# EAGLE design Design2d_fertig (EAGLE 7.2.0)
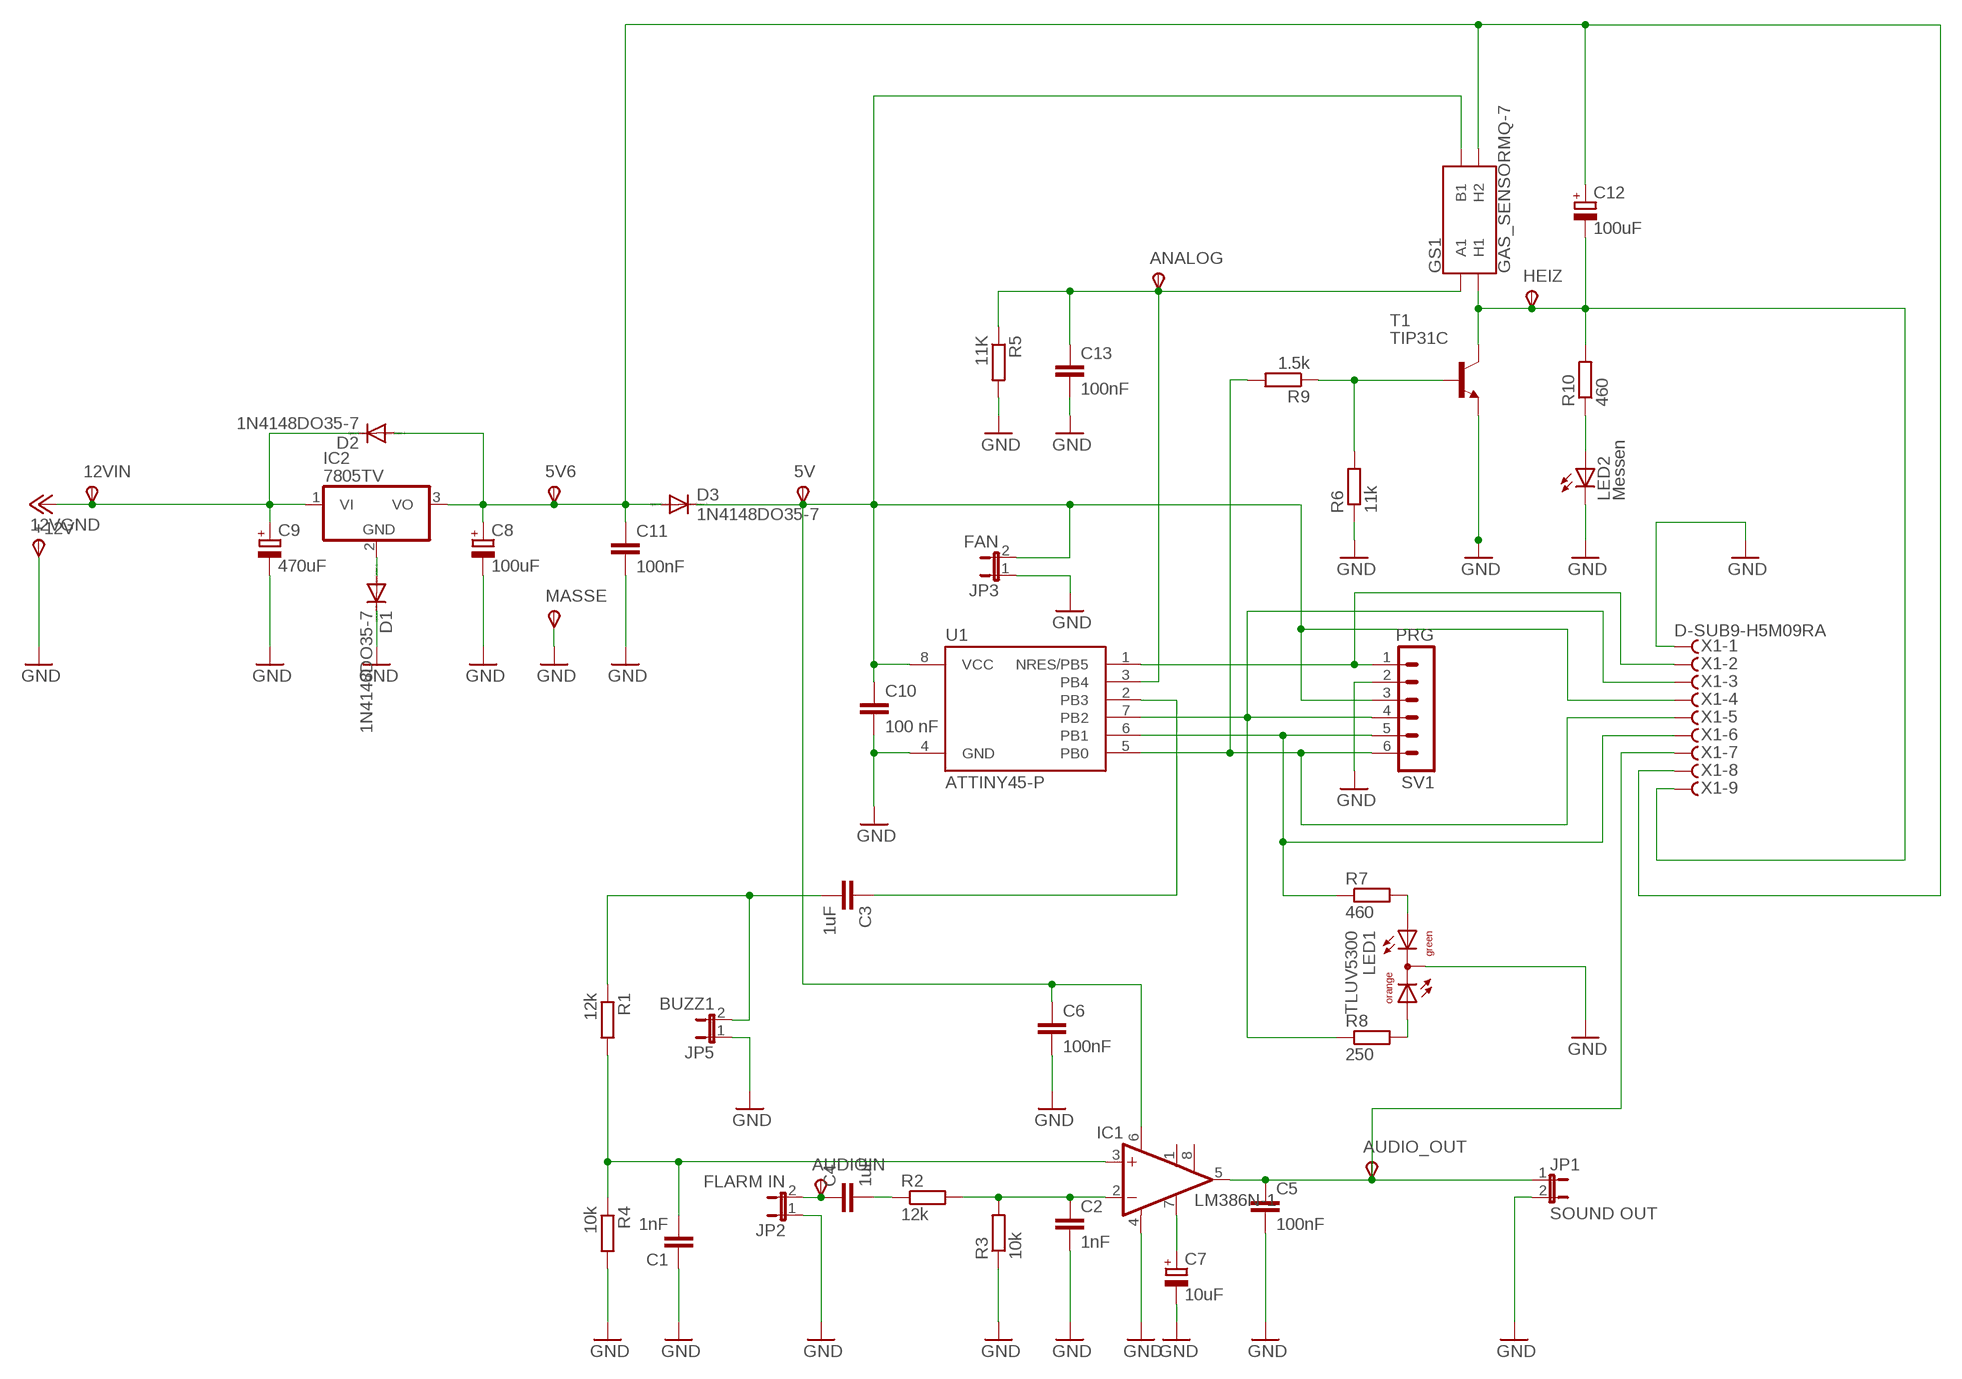
[diagram p0: schematic, sheet 1]

## Parts
5V  TPSPAD1-13  [P1-13]
5V6  TPSPAD1-13  [P1-13]
12VGND  TPSPAD1-13  [P1-13]
12VIN  TPSPAD1-13  [P1-13]
ANALOG  TPSPAD1-13  [P1-13]
AUDIO_OUT  TPSPAD1-13  [P1-13]
AUDIOIN  TPSPAD1-13  [P1-13]
C1  1nF  C-EU025-030X050  [C025-030X050]
C2  1nF  C-EU025-030X050  [C025-030X050]
C3  1uF  C-EU050-025X075  [C050-025X075]
C4  1uF  C-EU050-025X075  [C050-025X075]
C5  100nF  C-EU050-025X075  [C050-025X075]
C6  100nF  C-EU050-025X075  [C050-025X075]
C7  10uF  CPOL-EUE2.5-7  [E2,5-7]
C8  100uF  CPOL-EUE2.5-7  [E2,5-7]
C9  470uF  CPOL-EUE2.5-7  [E2,5-7]
C10  100 nF  C-EU050-024X044  [C050-024X044]
C11  100nF  C-EU050-025X075  [C050-025X075]
C12  100uF  CPOL-EUE2.5-7  [E2,5-7]
C13  100nF  C-EU050-025X075  [C050-025X075]
D1  1N4148DO35-7  [DO35-7]
D2  1N4148DO35-7  [DO35-7]
D3  1N4148DO35-7  [DO35-7]
GS1  GAS_SENSORMQ-7  [GAS_SENSOR]
HEIZ  TPSPAD1-13  [P1-13]
IC1  LM386N-1  [DIL08]
IC2  7805TV  [TO220V]
JP1  SOUND OUT  JP1E  [JP1]
JP2  FLARM IN  JP1E  [JP1]
JP3  FAN  JP1E  [JP1]
JP5  BUZZ1  JP1E  [JP1]
LED1  TLUV5300  [TLUV5300]
LED2  Messen  LED3MM  [LED3MM]
MASSE  TPSPAD1-13  [P1-13]
R1  12k  R-EU_0207/10  [0207/10]
R2  12k  R-EU_0207/10  [0207/10]
R3  10k  R-EU_0207/10  [0207/10]
R4  10k  R-EU_0207/10  [0207/10]
R5  11K  R-EU_0207/10  [0207/10]
R6  11k  R-EU_0207/10  [0207/10]
R7  460  R-EU_0207/10  [0207/10]
R8  250  R-EU_0207/10  [0207/10]
R9  1.5k  R-EU_0207/10  [0207/10]
R10  460  R-EU_0207/10  [0207/10]
SV1  PRG  MA06-1  [MA06-1]
T1  TIP31C  -NPN-TO220V  [TO220V]
U1  ATTINY45-P  [PDIP08_300MIL]
X1  D-SUB9-H5M09RA  [H5M09RA]

## Nets
5.6V: 5V6.TP(PP) C8.+ C11.1 C12.+ D2.A D3.A GS1.HB(H2) IC2.3(VO) X1.8
5V: 5V.TP(PP) C6.1 C10.1 D3.C GS1.B1 IC1.6(VS) JP3.2 SV1.3 U1.8(VCC) X1.4
+12V: 12VIN.TP(PP) C9.+ D2.C IC2.1(VI)
AUDIO: AUDIO_OUT.TP(PP) C5.1 IC1.5(OUT) JP1.1 X1.7
GND: 12VGND.TP(PP) C1.1 C2.2 C5.2 C6.2 C7.- C8.- C9.- C10.2 C11.2 C13.2 D1.C IC1.4(GND) JP1.2 JP2.1 JP3.1 JP5.1 LED1.CC LED2.K(C) MASSE.TP(PP) R3.1 R4.2 R5.2 R6.1 SV1.2 T1.3(E) U1.4(GND) X1.1
HEIZ: C12.- GS1.HA(H1) HEIZ.TP(PP) R10.2 T1.2(C) X1.9
N$1: C3.2 JP5.2 R1.1
N$2: C1.2 IC1.3(+IN) R1.2 R4.1
N$3: C2.1 IC1.2(-IN) R2.2 R3.2
N$5: SV1.1 U1.1(NRES/PB5) X1.2
N$6: C4.2 R2.1
N$7: R7.1 SV1.5 U1.6(PB1) X1.6
N$8: C7.+ IC1.7(BYPASS)
N$9: LED1.AG R7.2
N$11: LED1.AO R8.2
N$12: R8.1 SV1.4 U1.7(PB2) X1.3
N$13: C3.1 U1.2(PB3)
N$14: D1.A IC2.2(GND)
N$15: R9.2 SV1.6 U1.5(PB0) X1.5
N$16: ANALOG.TP(PP) C13.1 GS1.A1 R5.1 U1.3(PB4)
N$19: AUDIOIN.TP(PP) C4.1 JP2.2
N$22: R6.2 R9.1 T1.1(B)
N$23: LED2.A R10.1
Unconnected: IC1.1(GAIN) IC1.8(GAIN)

## Library data of the parts
5V 5V6 12VGND 12VIN ANALOG AUDIO_OUT AUDIOIN HEIZ MASSE = testpad:TPS: TEST PIN
C1-C6 C10 C11 C13 = resistor:C-EU: CAPACITOR, European symbol
C7-C9 C12 = resistor:CPOL-EU: POLARIZED CAPACITOR, European symbol
D1-D3 = diode:1N4148: DIODE high speed (Philips)
GS1 = spark-fun-GasSensors:GAS_SENSOR: Gas Sensors - MQ-3, MQ-4, MQ-6, MQ-7, MQ-8 Through-hole gas sensors with a heating coil and an analog output. Example Datasheet <https://cdn.sparkfun.com/datasheets/Sensors/Biometric/MQ-3%20ver1.3%20-%20Manual.pdf> SparkFun Products Gas Sensor Breakout Board <https://www.sparkfun.com/products/8891> (BOB-8891) - Breakout board compatible with all gas sensors. Alcohol Gas Sensor - MQ-3 <https://www.sparkfun.com/products/8880> (SEN-08880) Methane CNG Gas Sensor - MQ-4 <https://www.sparkfun.com/products/9404> (SEN-09404) LPG Gas Sensor - MQ-6 <https://www.sparkfun.com/products/9405> (SEN-09405) Carbon Monoxide Sensor - MQ-7 <https://www.sparkfun.com/products/9403> (SEN-09403) Hydrogen Gas Sensor - MQ-8 <https://www.sparkfun.com/products/10916> (SEN-10916); PROD_ID: COMP-12214; SF_ID: SEN-09403
IC1 = linear:LM386?-*: Low Voltage Audio Power Amplifier Source: http://cache.national.com/ds/LM/LM386.pdf
IC2 = linear:78*: Positive VOLTAGE REGULATOR Source: http://cache.national.com/ds/LM/LM78L05.pdf http://www.fairchildsemi.com/ds/LM/LM7805.pdf
JP1-JP3 JP5 = jumper:JP1E: JUMPER
LED1 = led:TLUV5300: Bicolor LED 5 mm Untinted Diffused Package Source: www.vishay.com .. Bi-Color LED Vashay TLUV5300.pdf
LED2 = led:LED: LED OSRAM: - CHIPLED LG R971, LG N971, LY N971, LG Q971, LY Q971, LO R971, LY R971 LH N974, LH R974 LS Q976, LO Q976, LY Q976 LO Q996 - Hyper CHIPLED LW Q18S LB Q993, LB Q99A, LB R99A - SideLED LS A670, LO A670, LY A670, LG A670, LP A670 LB A673, LV A673, LT A673, LW A673 LH A674 LY A675 LS A676, LA A676, LO A676, LY A676, LW A676 LS A679, LY A679, LG A679 - Hyper Micro SIDELED® LS Y876, LA Y876, LO Y876, LY Y876 LT Y87S - SmartLED LW L88C, LW L88S LB L89C, LB L89S, LG L890 LS L89K, LO L89K, LY L89K LS L896, LA L896, LO L896, LY L896 - TOPLED LS T670, LO T670, LY T670, LG T670, LP T670 LSG T670, LSP T670, LSY T670, LOP T670, LYG T670 LG T671, LOG T671, LSG T671 LB T673, LV T673, LT T673, LW T673 LH T674 LS T676, LA T676, LO T676, LY T676, LB T676, LH T676, LSB T676, LW T676 LB T67C, LV T67C, LT T67C, LS T67K, LO T67K, LY T67K, LW E67C LS E67B, LA E67B, LO E67B, LY E67B, LB E67C, LV E67C, LT E67C LW T67C LS T679, LY T679, LG T679 LS T770, LO T770, LY T770, LG T770, LP T770 LB T773, LV T773, LT T773, LW T773 LH T774 LS E675, LA E675, LY E675, LS T675 LS T776, LA T776, LO T776, LY T776, LB T776 LHGB T686 LT T68C, LB T68C - Hyper Mini TOPLED® LB M676 - Mini TOPLED Santana® LG M470 LS M47K, LO M47K, LY M47K Source: http://www.osram.convergy.de LUXEON: - LUMILED® LXK2-PW12-R00, LXK2-PW12-S00, LXK2-PW14-U00, LXK2-PW14-V00 LXK2-PM12-R00, LXK2-PM12-S00, LXK2-PM14-U00 LXK2-PE12-Q00, LXK2-PE12-R00, LXK2-PE12-S00, LXK2-PE14-T00, LXK2-PE14-U00 LXK2-PB12-K00, LXK2-PB12-L00, LXK2-PB12-M00, LXK2-PB14-N00, LXK2-PB14-P00, LXK2-PB14-Q00 LXK2-PR12-L00, LXK2-PR12-M00, LXK2-PR14-Q00, LXK2-PR14-R00 LXK2-PD12-Q00, LXK2-PD12-R00, LXK2-PD12-S00 LXK2-PH12-R00, LXK2-PH12-S00 LXK2-PL12-P00, LXK2-PL12-Q00, LXK2-PL12-R00 Source: www.luxeon.com KINGBRIGHT: KA-3528ASYC Source: www.kingbright.com
R1-R10 = resistor:R-EU_: RESISTOR, European symbol
SV1 = con-lstb:MA06-1: PIN HEADER; OC_FARNELL: unknown; OC_NEWARK: unknown
T1 = transistor:*-NPN-: NPN Transistror BF959 corrected 2008.03.06
U1 = _hhn_attiny25_45_85:ATTINY45*: ATMEL ATtiny 45 Packages: P = PDIP 08 30mil S = SOIC 08 EIAJ 208mil X = TSSOP 08 4.4mm Technologies Note: for complete ordering code (temp. range, finish, tape&reel etc.) see www.atmel.com • Supply Voltage: V = (1.8…5.5)V | [blank] = (2.7…5.5)V • Speed: 10 = 10 MHz | 20 = 20 MHz Author: Dipl.-Ing. FH Rainer Bayer HHN Hochschule Heilbronn (Heilbronn University), rainer.bayer@hs-heilbronn.de Ingenieurbüro ing-rb, mail@ing-rb.de
X1 = con-thomas-betts:D-SUB9-: D-Subminiatur Connector Source: Electronioc Interconnects European Edition 1998; OC_FARNELL: unknown; OC_NEWARK: unknown

## Board
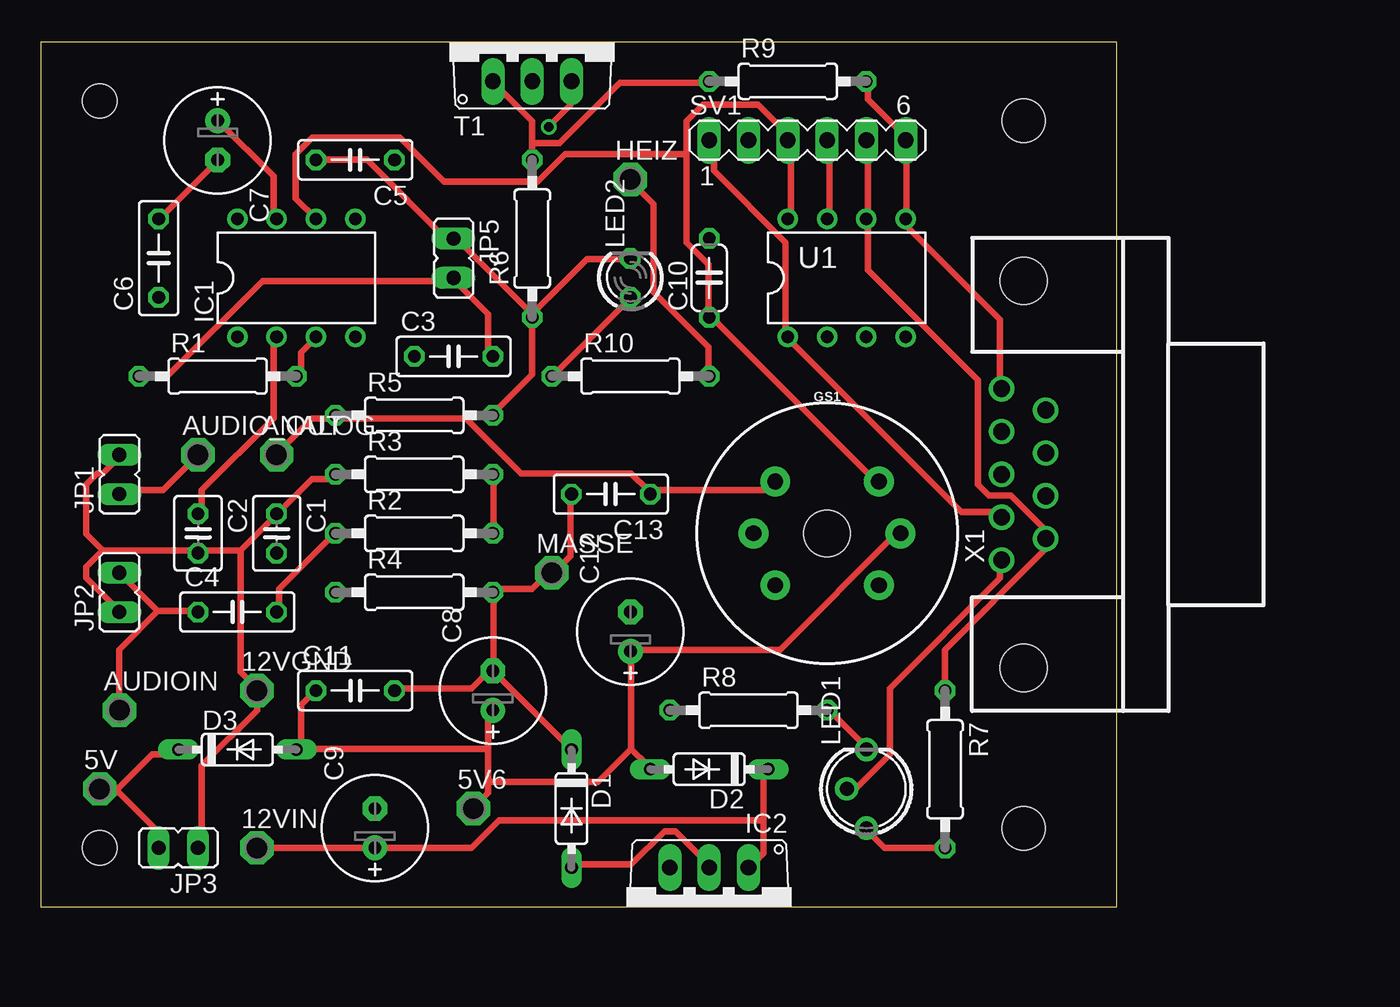
[diagram p1: board, top side]
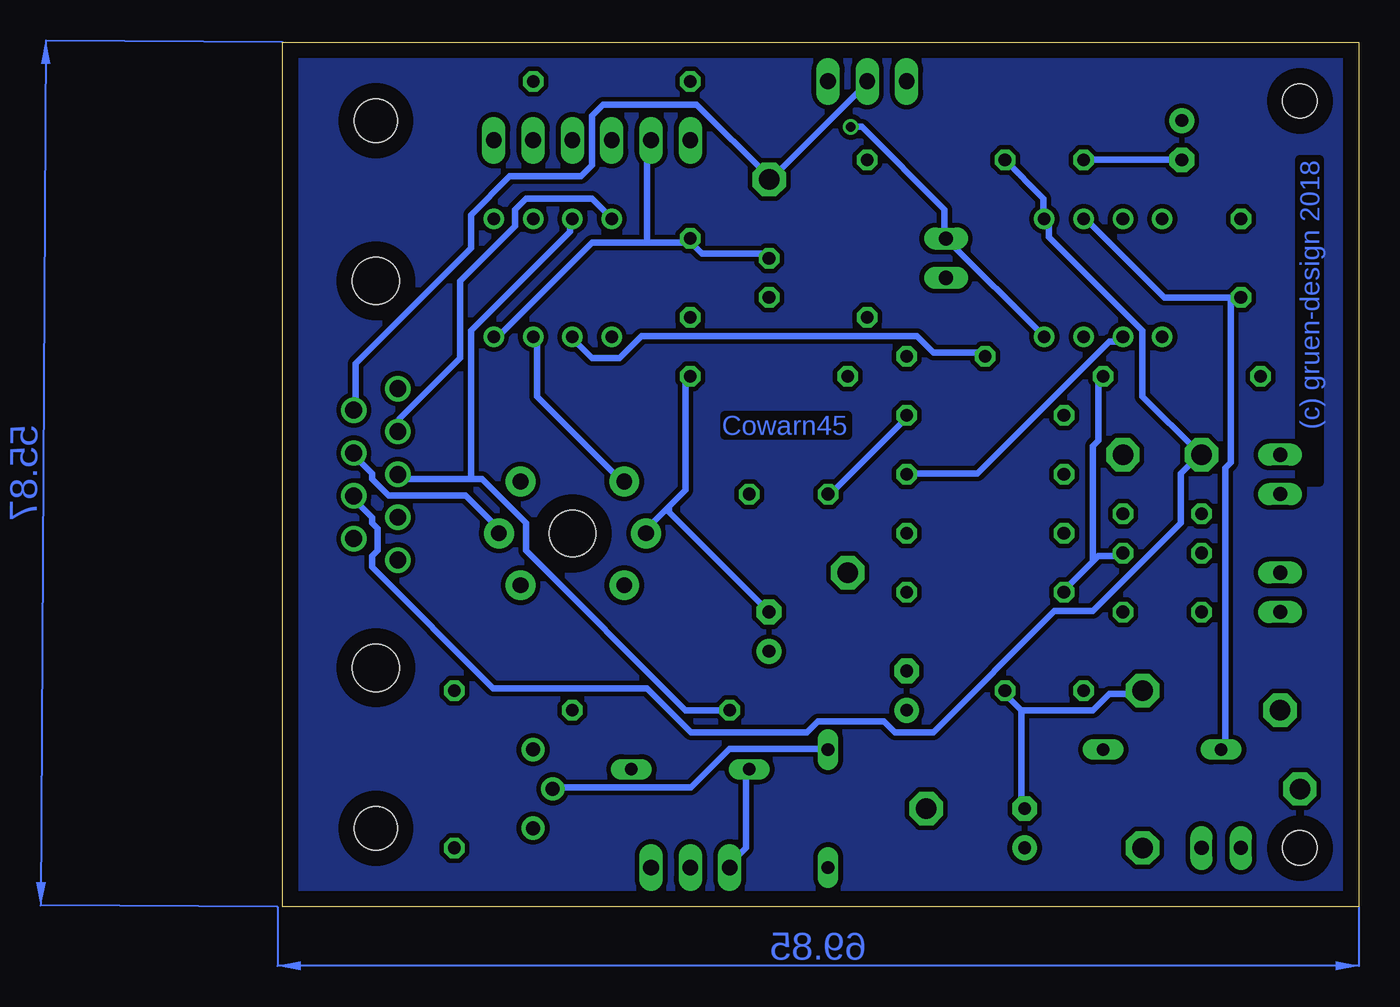
[diagram p2: board, bottom side, seen from below]

Size 69.52 x 55.87 mm. Coordinates in mm from the lower left corner, seen from the top.
Outline: 0,0 69.52,0 69.52,55.87 0,55.87 0,0
Copper layers (1*16): Top 0.035mm / dielectric 1.5mm / Bottom 0.035mm
Design rules "default *": minimum track width 16mil, minimum drill 24mil, track to track 12mil, track to pad 12mil, pad to pad 12mil, via to via 12mil, smd to smd 12mil, copper to edge 40mil, drill to drill 12mil, minimum pad ring 10mil, minimum via ring 8mil, stop-mask expansion 4mil, vias tented up to drill 0mil, thermal gap 10mil
Holes 2.2 mm at 3.81,52.07 3.81,3.81
Holes 2.8 mm at 63.5,50.8 63.5,5.08

### Footprints (pad centres in the part's own frame; a part is rotated, then mirrored left to right if it is on the bottom)
P1-13 = drill 1.321 pad 2.159 octagon: TP 0,0
C025-030X050 = drill 0.813 octagon: 1 -1.27,0; 2 1.27,0
C050-025X075 = drill 0.813 octagon: 1 -2.54,0; 2 2.54,0
E2,5-7 = drill 0.813 pad 1.6: + -1.27,0 | drill 0.813 pad 1.6 octagon: - 1.27,0
C050-024X044 = drill 0.813 octagon: 1 -2.54,0; 2 2.54,0
DO35-7 = drill 0.813 long: A 3.81,0; C -3.81,0
GAS_SENSOR = drill 1.016 pad 1.93: A1 -3.35,3.35; A2 -3.35,-3.35; B1 3.35,3.35; B2 3.35,-3.35; HA -4.75,0; HB 4.75,0 | hole 3: 0,0
DIL08 = drill 0.813 pad 1.27: 1 -3.81,-3.81; 2 -1.27,-3.81; 3 1.27,-3.81; 4 3.81,-3.81; 5 3.81,3.81; 6 1.27,3.81; 7 -1.27,3.81; 8 -3.81,3.81
TO220V = drill 1.016 long: 1 -2.54,-2.54; 2 0,-2.54; 3 2.54,-2.54
JP1 = drill 0.914 long: 1 0,-1.27; 2 0,1.27
TLUV5300 = drill 0.9 pad 1.5: AG 2.54,0; AO -2.54,0; CC 0,-1.27
LED3MM = drill 0.813 octagon: A -1.27,0; K 1.27,0
0207/10 = drill 0.813 octagon: 1 -5.08,0; 2 5.08,0
MA06-1 = drill 1.016 long: 1 -6.35,0; 2 -3.81,0; 3 -1.27,0; 4 1.27,0; 5 3.81,0; 6 6.35,0
PDIP08_300MIL = drill 0.813: 1 -3.81,-3.81; 2 -1.27,-3.81; 3 1.27,-3.81; 4 3.81,-3.81; 5 3.81,3.81; 6 1.27,3.81; 7 -1.27,3.81; 8 -3.81,3.81
H5M09RA = drill 1.092: 1 -5.537,1.422; 2 -2.769,1.422; 3 0,1.422; 4 2.769,1.422; 5 5.537,1.422; 6 -4.153,-1.422; 7 -1.384,-1.422; 8 1.384,-1.422; 9 4.153,-1.422 | hole 3.048: -12.497,0; 12.497,0

### Placement (x,y rotation side)
5V  3.81,7.62 0 top
5V6  27.94,6.35 0 top
12VGND  13.97,13.97 0 top
12VIN  13.97,3.81 0 top
ANALOG  15.24,29.21 0 top
AUDIO_OUT  10.16,29.21 0 top
AUDIOIN  5.08,12.7 0 top
C1  15.24,24.13 270 top
C2  10.16,24.13 270 top
C3  26.67,35.56 0 top
C4  12.7,19.05 0 top
C5  20.32,48.26 180 top
C6  7.62,41.91 90 top
C7  11.43,49.53 270 top
C8  29.21,13.97 90 top
C9  21.59,5.08 90 top
C10  43.18,40.64 90 top
C11  20.32,13.97 0 top
C12  38.1,17.78 90 top
C13  36.83,26.67 180 top
D1  34.29,6.35 270 top
D2  43.18,8.89 180 top
D3  12.7,10.16 0 top
GS1  50.8,24.13 0 top
HEIZ  38.1,46.99 0 top
IC1  16.51,40.64 0 top
IC2  43.18,0 180 top
JP1  5.08,27.94 0 top
JP2  5.08,20.32 0 top
JP3  8.89,3.81 90 top
JP5  26.67,41.91 180 top
LED1  53.34,7.62 270 top
LED2  38.1,40.64 90 top
MASSE  33.02,21.59 0 top
R1  11.43,34.29 0 top
R2  24.13,24.13 0 top
R3  24.13,27.94 0 top
R4  24.13,20.32 0 top
R5  24.13,31.75 0 top
R6  31.75,43.18 90 top
R7  58.42,8.89 270 top
R8  45.72,12.7 0 top
R9  48.26,53.34 0 top
R10  38.1,34.29 0 top
SV1  49.53,49.53 0 top
T1  31.75,55.88 0 top
U1  52.07,40.64 0 top
X1  63.5,27.94 90 top

### Tracks (layer width: path | path; a pad name or v marks a point on that pad's centre or on a via)
5.6V
  Top 0.406: 16.82,10.21 16.82,13.06 17.53,13.77 C11.1 | 28.9,8.08 28.9,7.37 28.19,6.66 5V6.TP | 28.9,8.08 28.9,10.21 | 28.9,10.21 28.9,12.7 C8.+ | 28.9,10.21 16.82,10.21 | 16.82,10.21 D3.A | 38.15,10.21 38.15,16.26 C12.+ 38.15,16.61 47.75,16.61 55.22,24.08 GS1.HB | 38.15,10.21 39.22,9.14 D2.A | 28.9,8.08 36.02,8.08 38.15,10.21
  Bottom 0.406: X1.8 64.82,29.06 63.75,27.99 63.75,27.63 62.69,26.57 57.71,26.57 55.58,24.44 GS1.HB | D2.A 39.57,8.79 39.57,3.81 40.64,2.74 IC2.3
5V
  Top 0.406: GS1.B1 53.8,27.63 43.48,37.95 C10.1 43.13,38.3 43.13,41.5 41.71,42.93 41.71,48.62 | U1.8 48.46,44.7 48.46,49.33 SV1.3 48.46,49.68 46.33,51.82 42.77,51.82 41.71,50.75 41.71,48.62 | D3.C 8.64,9.86 7.21,9.86 5.08,7.72 5V.TP 5.08,7.37 7.57,4.88 7.57,3.81 JP3.2 | 41.71,48.62 33.88,48.62 32.11,46.84 26.06,46.84 23.22,49.68 17.53,49.68 16.46,48.62 16.46,45.77 IC1.6
  Bottom 0.406: X1.4 61.98,30.84 61.98,31.55 58.06,35.46 58.06,40.44 54.51,43.99 54.51,45.06 53.8,45.77 49.53,45.77 48.46,44.7 U1.8 | 8.28,39.37 12.55,39.37 17.53,44.35 IC1.6 | 8.28,39.37 C6.1 | 8.28,39.37 8.28,28.7 8.64,28.35 8.64,10.21 D3.C
+12V
  Top 0.406: 46.69,5.59 46.69,3.45 45.97,2.74 IC2.1 | 46.69,5.59 46.69,8.79 D2.C | 12VIN.TP C9.+ 27.84,3.81 29.62,5.59 46.69,5.59
AUDIO
  Top 0.406: JP1.1 5.08,26.92 7.93,26.92 10.06,29.06 AUDIO_OUT.TP
  Bottom 0.406: C5.1 20.37,45.77 20.37,44.7 IC1.5 20.01,44.35 20.01,43.28 13.97,37.24 13.97,32.97 10.41,29.41 AUDIO_OUT.TP 10.41,29.06 11.48,27.99 11.48,24.79 17.17,19.1 19.66,19.1 27.48,11.28 29.97,11.28 30.68,11.99 34.95,11.99 35.66,11.28 43.13,11.28 45.97,14.12 55.93,14.12 63.75,21.95 63.75,22.66 63.4,23.01 63.4,24.44 63.75,24.79 63.75,25.15 64.82,26.21 X1.7
GND  (via drill 0.61)
  Top 0.406: C6.2 7.93,44.7 11.48,48.26 C7.- | 31.75,38.3 26.77,43.28 JP5.1 26.42,42.93 21.08,48.26 C5.2 | v32.82,50.39 34.24,51.82 34.24,53.24 T1.3 | 31.75,38.3 35.31,41.86 37.8,41.86 LED2.K | 31.75,38.3 R6.1 31.75,34.39 29.26,31.9 R5.2 | 12.9,23.01 10.41,23.01 C2.2 10.06,23.01 4.01,23.01 | 12.9,23.01 15.04,25.15 C1.1 15.39,25.5 17.53,27.63 18.95,27.63 R3.1 | 4.01,23.01 2.95,21.95 2.95,21.23 5.08,19.1 JP2.1 | 4.01,23.01 2.95,24.08 2.95,27.28 3.66,27.99 4.01,27.99 5.08,29.06 JP1.2 | JP3.1 10.41,3.81 10.41,9.14 13.97,12.7 12VGND.TP 13.97,14.12 12.9,15.19 12.9,23.01 | C13.2 34.24,26.57 34.24,22.66 33.17,21.59 MASSE.TP 32.82,21.59 31.75,20.52 29.26,20.52 R4.2 29.26,20.17 29.26,15.55 C8.- | C11.2 22.86,14.12 27.84,14.12 28.9,15.19 C8.- | C8.- D1.C | X1.1 61.98,22.3 61.98,21.23 54.86,14.12 54.86,9.86 52.38,7.37 LED1.CC
  Bottom 0.406: LED2.K 38.15,42.22 42.42,42.22 43.13,42.93 C10.2 43.48,42.93 45.97,42.93 | 45.97,42.93 49.53,42.93 55.58,36.88 U1.4 | 45.97,42.93 45.97,49.33 SV1.2 | C7.- C5.2 | IC1.4 JP5.1 26.77,43.28 26.77,45.06 32.11,50.39 v32.82,50.39 | R5.2 29.26,31.55 34.24,26.57 C13.2 | LED1.CC 52.02,7.72 43.13,7.72 40.64,10.21 34.59,10.21 D1.C | 21.79,12.7 21.79,6.66 C9.- | 21.79,12.7 22.86,13.77 C11.2 | 21.79,12.7 17.17,12.7 16.1,13.77 13.97,13.77 12VGND.TP
HEIZ
  Top 0.406: R10.2 43.13,34.39 43.13,36.17 39.57,39.73 39.57,45.42 38.15,46.84 HEIZ.TP
  Bottom 0.406: 44.55,25.86 45.97,24.44 GS1.HA | 44.55,25.86 43.48,26.92 43.48,34.04 R10.2 | C12.- 44.55,25.5 44.55,25.86 | T1.2 31.75,53.24 37.8,47.19 HEIZ.TP 38.15,47.19 42.77,51.82 48.82,51.82 49.53,51.11 49.53,47.9 50.24,47.19 54.86,47.19 57.35,44.7 57.35,42.57 64.82,35.1 64.82,32.26 X1.9
N$1
  Top 0.406: R1.1 6.5,34.39 8.28,34.39 14.33,40.44 26.42,40.44 JP5.2 26.77,40.44 28.9,38.3 28.9,35.81 C3.2
N$2
  Top 0.406: R1.2 16.82,34.39 16.82,35.81 17.53,36.52 IC1.3
  Bottom 0.406: 17.17,22.3 18.95,20.52 R4.1 | 17.17,22.3 16.82,22.66 15.39,22.66 C1.2 | 17.17,22.3 17.17,29.77 16.82,30.12 16.82,34.04 R1.2
N$3
  Top 0.406: R2.2 29.26,24.44 29.26,27.63 R3.2 | C2.1 10.41,25.5 10.41,26.92 15.04,31.55 15.04,36.52 IC1.2
  Bottom 0.406: R3.2 28.9,27.99 24.64,27.99 16.1,36.52 15.39,36.52 IC1.2
N$4
  pour Bottom: 0,55.88 69.85,55.88 69.85,0 0,0
N$5
  Top 0.406: SV1.1 43.48,49.33 43.48,47.55 48.11,42.93 48.11,36.88 U1.1 48.46,36.52 59.49,25.5 61.98,25.5 X1.2
N$6
  Top 0.406: C4.2 15.39,19.1 15.39,20.52 18.95,24.08 R2.1
N$7
  Top 0.406: SV1.5 53.44,49.33 53.44,44.7 U1.6 53.44,44.35 53.44,41.15 60.55,34.04 60.55,27.28 61.27,26.57 62.69,26.57 65.18,24.08 X1.6 64.82,23.72 64.82,23.01 58.42,16.61 R7.1
N$8
  Top 0.406: C7.+ 15.04,47.19 15.04,44.7 IC1.7
N$9
  Top 0.406: R7.2 54.51,3.81 53.44,4.88 LED1.AG
N$11
  Top 0.406: R8.2 50.95,12.7 53.44,10.21 LED1.AO
N$12
  Top 0.406: U1.7 50.95,44.7 50.95,49.33 SV1.4
  Bottom 0.406: R8.1 43.48,12.7 53.8,23.01 53.8,24.79 56.64,27.63 57.35,27.63 | 57.35,27.63 61.98,27.63 X1.3 | 57.35,27.63 57.35,37.24 50.95,43.64 50.95,44.35 U1.7
N$13
  Bottom 0.406: C3.1 24.28,35.81 27.48,35.81 28.55,36.88 46.33,36.88 47.75,35.46 49.53,35.46 50.6,36.52 U1.2
N$14
  Top 0.406: D1.A 34.59,2.74 38.15,2.74 40.28,4.88 41,4.88 43.13,2.74 IC2.2
N$15
  Top 0.406: R9.2 53.44,53.24 53.44,52.17 55.93,49.68 SV1.6 55.93,49.33 55.93,44.7 U1.5 55.58,44.35 61.98,37.95 61.98,33.68 X1.5
N$16
  Top 0.406: ANALOG.TP 15.39,29.41 17.53,31.55 18.95,31.55 R5.1 19.3,31.55 27.48,31.55 31.04,27.99 38.15,27.99 39.22,26.92 C13.1 39.57,26.92 47.04,26.92 47.4,27.28 GS1.A1
  Bottom 0.406: U1.3 53.09,36.52 53.09,32.97 47.75,27.63 GS1.A1
N$19
  Top 0.406: 7.57,19.1 10.06,19.1 C4.1 | JP2.2 7.57,19.1 | AUDIOIN.TP 5.08,16.61 7.57,19.1
N$22
  Top 0.406: 31.75,49.33 31.75,50.75 29.26,53.24 T1.1 | 31.75,49.33 R6.2 | 31.75,49.33 33.53,49.33 37.44,53.24 43.13,53.24 R9.1
N$23
  Top 0.406: R10.1 33.17,34.39 38.15,39.37 LED2.A
(copper drawn outside any net)
  shapes: Bottom area x2

### Text on the board
Bottom: (c) gruen-design 2018 | Cowarn45